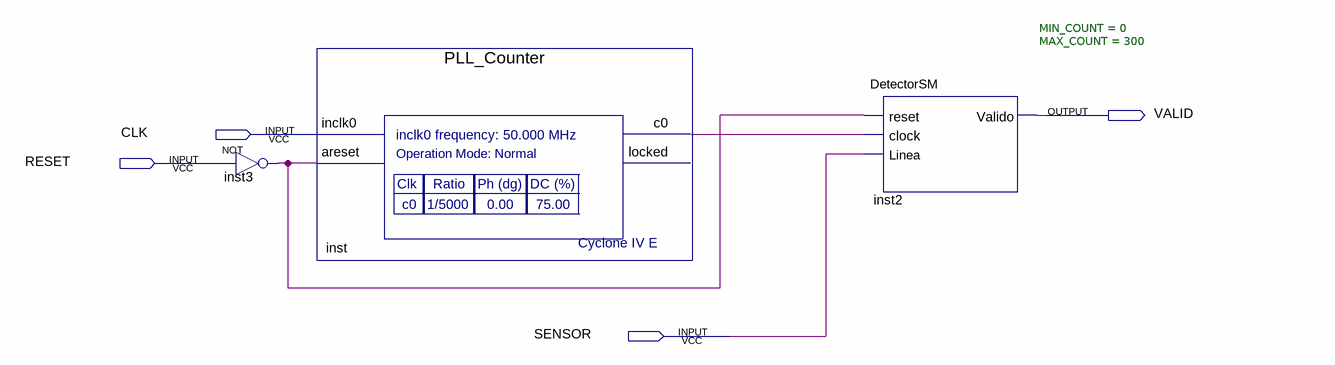
[diagram p0: schematic sheet]
// Quartus schematic DetectorSCH.bdf as structural Verilog: 3 symbols, 4 pins
module DetectorSCH (
  input  CLK,
  input  RESET,
  input  SENSOR,
  output VALID
);

  wire inst3_out, inst_c0;

  not inst3 (inst3_out, RESET);
  PLL_Counter inst (.inclk0(CLK), .areset(inst3_out), .c0(inst_c0));  // open: locked
  DetectorSM #(.MIN_COUNT(0), .MAX_COUNT(300)) inst2 (
    .reset(inst3_out), .clock(inst_c0), .Linea(SENSOR), .Valido(VALID));
endmodule
